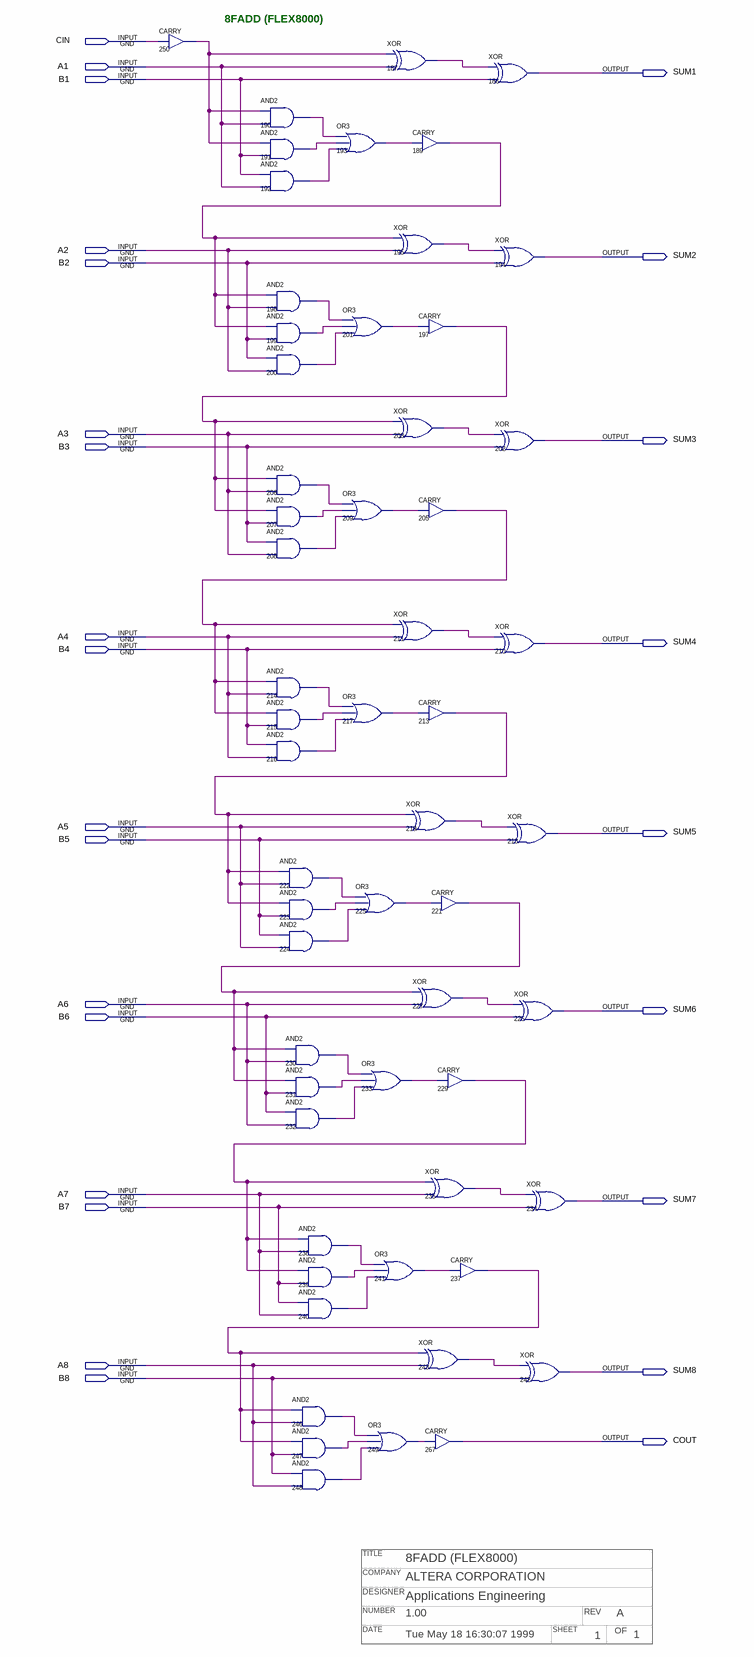
[diagram p0: schematic sheet]
// Quartus schematic f8fadd.bdf as structural Verilog: 57 symbols, 26 pins
// Title block: TITLE: 8FADD (FLEX8000); COMPANY: ALTERA CORPORATION; DESIGNER: Applications Engineering; NUMBER: 1.00; REV: A; DATE: Tue May 18 16:30:07 1999; SHEET: 1; OF: 1
module f8fadd (
  input  CIN,
  input  A1,
  input  B1,
  input  A2,
  input  B2,
  input  A3,
  input  B3,
  input  A4,
  input  B4,
  input  A5,
  input  B5,
  input  A6,
  input  B6,
  input  A7,
  input  B7,
  input  A8,
  input  B8,
  output SUM1,
  output SUM2,
  output SUM3,
  output SUM4,
  output SUM5,
  output SUM6,
  output SUM7,
  output SUM8,
  output COUT
);

  wire n187_out, n189_out, n190_out, n191_out, n192_out, n193_out, n195_out, n197_out, n198_out, n199_out,
       n200_out, n201_out, n203_out, n205_out, n206_out, n207_out, n208_out, n209_out, n211_out, n213_out,
       n214_out, n215_out, n216_out, n217_out, n219_out, n221_out, n222_out, n223_out, n224_out, n225_out,
       n227_out, n229_out, n230_out, n231_out, n232_out, n233_out, n235_out, n237_out, n238_out, n239_out,
       n240_out, n241_out, n243_out, n246_out, n247_out, n248_out, n249_out, n250_out;

  CARRY u_250 (.IN(CIN), .OUT(n250_out));
  and u_190 (n190_out, n250_out, A1);
  and u_191 (n191_out, n250_out, B1);
  and u_192 (n192_out, B1, A1);
  and u_198 (n198_out, n189_out, A2);
  and u_199 (n199_out, n189_out, B2);
  and u_200 (n200_out, B2, A2);
  and u_206 (n206_out, n197_out, A3);
  and u_207 (n207_out, n197_out, B3);
  and u_208 (n208_out, B3, A3);
  and u_214 (n214_out, n205_out, A4);
  and u_215 (n215_out, n205_out, B4);
  and u_216 (n216_out, B4, A4);
  and u_222 (n222_out, n213_out, A5);
  and u_223 (n223_out, n213_out, B5);
  and u_224 (n224_out, B5, A5);
  and u_230 (n230_out, n221_out, A6);
  and u_231 (n231_out, n221_out, B6);
  and u_232 (n232_out, B6, A6);
  and u_246 (n246_out, n237_out, A8);
  and u_247 (n247_out, n237_out, B8);
  and u_248 (n248_out, B8, A8);
  or u_193 (n193_out, n190_out, n191_out, n192_out);
  or u_201 (n201_out, n198_out, n199_out, n200_out);
  or u_209 (n209_out, n206_out, n207_out, n208_out);
  or u_217 (n217_out, n214_out, n215_out, n216_out);
  and u_238 (n238_out, n229_out, A7);
  and u_239 (n239_out, n229_out, B7);
  and u_240 (n240_out, B7, A7);
  xor u_187 (n187_out, n250_out, A1);
  xor u_195 (n195_out, n189_out, A2);
  xor u_203 (n203_out, n197_out, A3);
  xor u_211 (n211_out, n205_out, A4);
  or u_225 (n225_out, n222_out, n223_out, n224_out);
  or u_233 (n233_out, n230_out, n231_out, n232_out);
  or u_241 (n241_out, n238_out, n239_out, n240_out);
  or u_249 (n249_out, n246_out, n247_out, n248_out);
  CARRY u_189 (.IN(n193_out), .OUT(n189_out));
  CARRY u_197 (.IN(n201_out), .OUT(n197_out));
  CARRY u_205 (.IN(n209_out), .OUT(n205_out));
  CARRY u_213 (.IN(n217_out), .OUT(n213_out));
  xor u_219 (n219_out, n213_out, A5);
  CARRY u_221 (.IN(n225_out), .OUT(n221_out));
  xor u_227 (n227_out, n221_out, A6);
  CARRY u_229 (.IN(n233_out), .OUT(n229_out));
  xor u_235 (n235_out, n229_out, A7);
  xor u_243 (n243_out, n237_out, A8);
  CARRY u_267 (.IN(n249_out), .OUT(COUT));
  xor u_186 (SUM1, n187_out, B1);
  xor u_194 (SUM2, n195_out, B2);
  xor u_202 (SUM3, n203_out, B3);
  xor u_210 (SUM4, n211_out, B4);
  CARRY u_237 (.IN(n241_out), .OUT(n237_out));
  xor u_218 (SUM5, n219_out, B5);
  xor u_226 (SUM6, n227_out, B6);
  xor u_234 (SUM7, n235_out, B7);
  xor u_242 (SUM8, n243_out, B8);

  // Notes on the sheet:
  //   8FADD (FLEX8000)
endmodule
